# EAGLE design 5v-to3 (EAGLE 7.7.0)
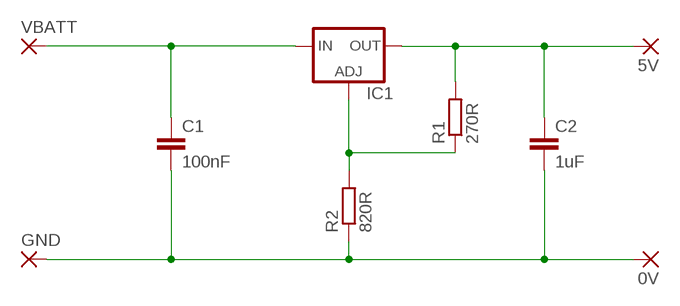
[diagram p0: schematic, sheet 1]

## Parts
0V  WIREPAD4,16O1,6  [4,16O1,6]
5V  WIREPAD4,16O1,6  [4,16O1,6]
C1  100nF  C-EU050-024X044  [C050-024X044]
C2  1uF  C-EU050-024X044  [C050-024X044]
GND  WIREPAD4,16O1,6  [4,16O1,6]
IC1  LM138-TO3  [TO3-K02]
R1  270R  R-EU_0207/7  [0207/7]
R2  820R  R-EU_0207/7  [0207/7]
VBATT  WIREPAD4,16O1,6  [4,16O1,6]

## Nets
5V: 5V.1(P) C2.1 IC1.3(OUT) R1.2
ADJ: IC1.2(ADJ) R1.1 R2.2
GND: 0V.1(P) C1.2 C2.2 GND.1(P) R2.1
VBATT: C1.1 IC1.1(IN) VBATT.1(P)

## Library data of the parts
0V 5V GND VBATT = wirepad:WIREPAD: Wire PAD connect wire on PCB
C1 C2 = resistor:C-EU: CAPACITOR, European symbol
IC1 = v-reg:LM138-TO3: VOLTAGE REGULATOR
R1 R2 = resistor:R-EU_: RESISTOR, European symbol

## Board
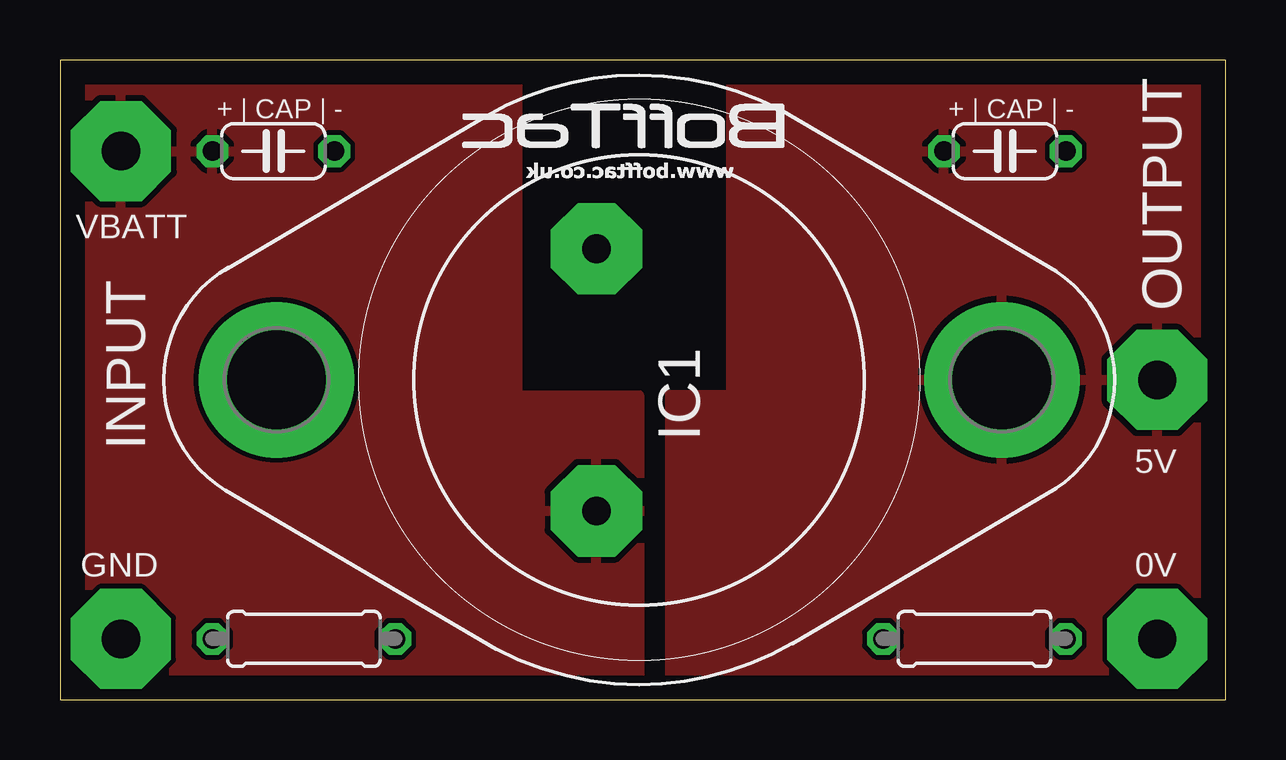
[diagram p1: board, top side]
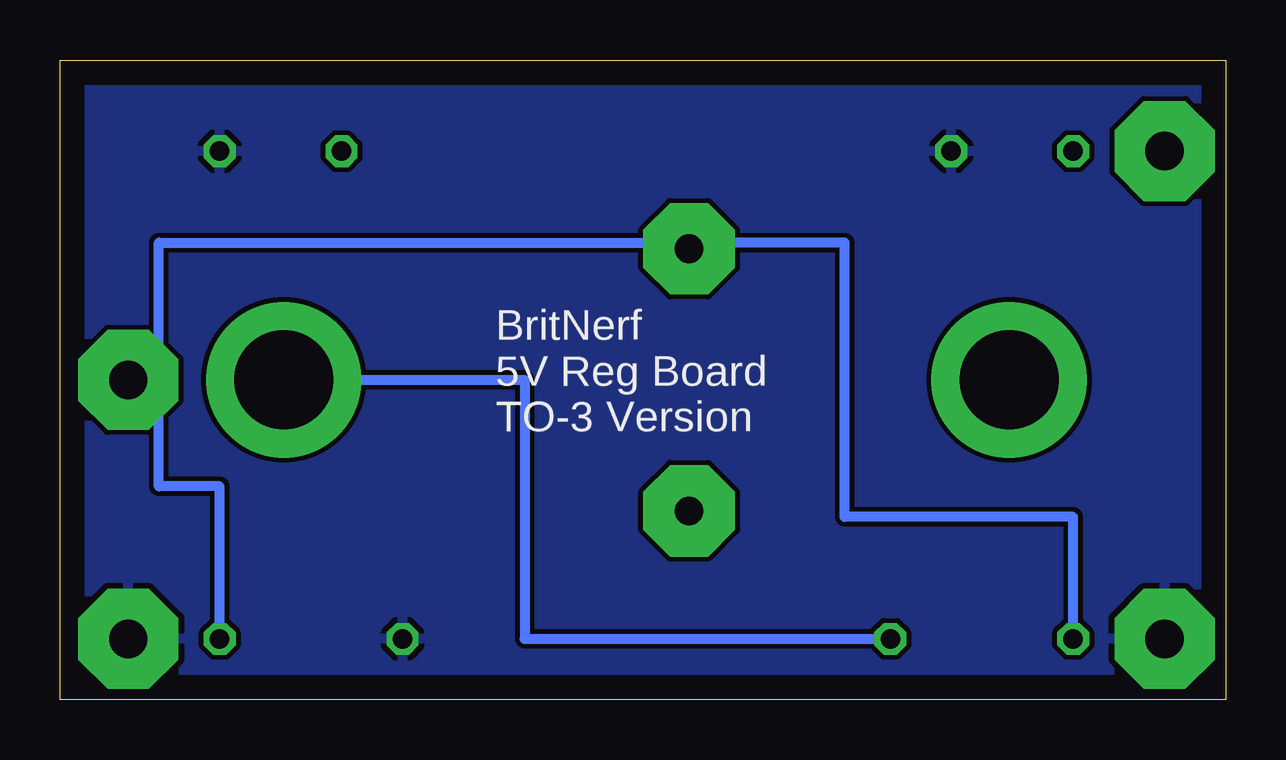
[diagram p2: board, bottom side, seen from below]

Size 48.56 x 26.66 mm. Coordinates in mm from the lower left corner, seen from the top.
Outline: 0,0 48.56,0 48.56,26.66 0,26.66 0,0
Copper layers (1*16): Top 0.035mm / dielectric 1.5mm / Bottom 0.035mm
Design rules "default": minimum track width 10mil, minimum drill 24mil, track to track 8mil, track to pad 8mil, pad to pad 8mil, via to via 8mil, smd to smd 8mil, copper to edge 40mil, drill to drill 8mil, minimum pad ring 10mil, minimum via ring 8mil, stop-mask expansion 4mil, vias tented up to drill 0mil, thermal gap 10mil

### Footprints (pad centres in the part's own frame; a part is rotated, then mirrored left to right if it is on the bottom)
4,16O1,6 = drill 1.6 pad 4.166 octagon: 1 0,0
C050-024X044 = drill 0.813 octagon: 1 -2.54,0; 2 2.54,0
TO3-K02 = drill 1.194 pad 3.81 octagon: 1 -1.778,-5.461; 2 -1.778,5.461 | drill 4.115 pad 6.477: 3 15.113,0; 3@ -15.113,0
0207/7 = drill 0.813 octagon: 1 -3.81,0; 2 3.81,0

### Placement (x,y rotation side)
0V  45.72,2.54 0 top
5V  45.72,13.34 0 top
C1  8.89,22.86 0 top
C2  39.37,22.86 0 top
GND  2.54,2.54 0 top
IC1  24.13,13.34 0 top
R1  10.16,2.54 0 top
R2  38.1,2.54 0 top
VBATT  2.54,22.86 0 top

### Tracks (layer width: path | path; a pad name or v marks a point on that pad's centre or on a via)
5V
  Bottom 0.406: IC1.3 29.21,13.34 29.21,2.54 R1.2
  pour Top: 48.26,26.67 27.94,26.67 27.94,12.7 25.4,12.7 25.4,0 48.26,0
ADJ
  Bottom 0.406: R1.1 6.35,7.62 15.88,7.62 15.88,19.05 22.35,19.05 | R2.2 41.91,8.89 44.45,8.89 44.45,19.05 22.35,19.05 | 22.35,19.05 IC1.2
GND
  pour Bottom: 0,26.67 0,0 48.26,0 48.26,26.67
VBATT
  pour Top: 0,26.67 19.05,26.67 19.05,12.7 24.13,12.7 24.13,0 0,0

### Text on the board
tNames: + | CAP | - | + | CAP | - | OUTPUT | INPUT
bNames: BritNerf / 5V Reg Board / TO-3 Version | Y:/BoffTac/Logo/monologo-w-address.bmp